# Altium schematic sheet Sheet3.SchDoc
size A4; SheetNumber: 2; SheetTotal: 2
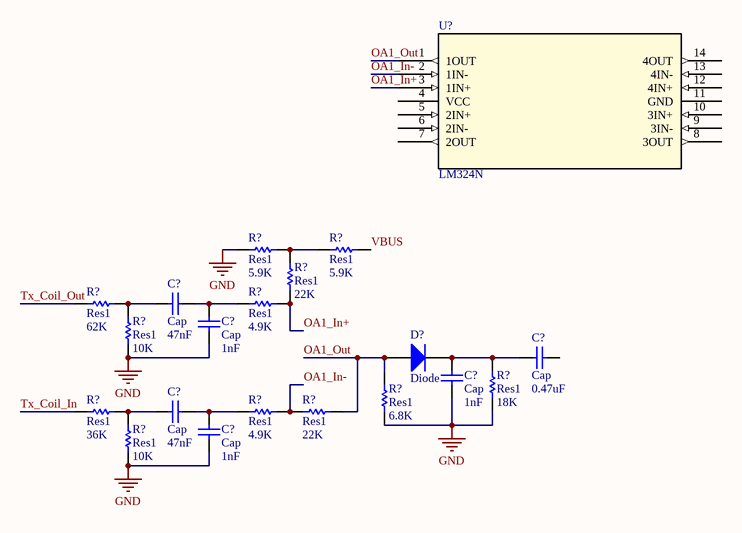
[diagram p0: Sheet3.SchDoc]

## Parts
(Parts that share a designator on the sheet are numbered #1, #2 ... from top to bottom, then left to right.)
C?#1  Cap  value 47nF  [RAD-0.3]
C?#2  Cap  value 1nF  [RAD-0.3]
C?#3  Cap  value 0.47uF  [RAD-0.3]
C?#4  Cap  value 1nF  [RAD-0.3]
C?#5  Cap  value 47nF  [RAD-0.3]
C?#6  Cap  value 1nF  [RAD-0.3]
D?  Diode  [SMC]
R?#1  Res1  value 5.9K  [AXIAL-0.3]
R?#2  Res1  value 5.9K  [AXIAL-0.3]
R?#3  Res1  value 22K  [AXIAL-0.3]
R?#4  Res1  value 62K  [AXIAL-0.3]
R?#5  Res1  value 10K  [AXIAL-0.3]
R?#6  Res1  value 4.9K  [AXIAL-0.3]
R?#7  Res1  value 18K  [AXIAL-0.3]
R?#8  Res1  value 6.8K  [AXIAL-0.3]
R?#9  Res1  value 36K  [AXIAL-0.3]
R?#10  Res1  value 4.9K  [AXIAL-0.3]
R?#11  Res1  value 22K  [AXIAL-0.3]
R?#12  Res1  value 10K  [AXIAL-0.3]
U?  LM324N  [N14]

## Nets
GND: C?#2.1 C?#4.2 C?#6.2 R?#2.2 R?#5.2 R?#7.2 R?#8.2 R?#12.1
OA1_In+: R?#3.2 R?#6.1 U?.3(1IN+)
OA1_In-: R?#10.2 R?#11.1 U?.2(1IN-)
OA1_Out: D?.1(A) R?#8.1 R?#11.2 U?.1(1OUT)
Tx_Coil_In: R?#9.1
Tx_Coil_Out: R?#4.2
VBUS: R?#1.2
NetC?#1_1: C?#1.1 R?#4.1 R?#5.1
NetC?#1_2: C?#1.2 C?#2.2 R?#6.2
NetC?#3_1: C?#3.1 C?#4.1 D?.2(K) R?#7.1
NetC?#5_1: C?#5.1 R?#9.2 R?#12.2
NetC?#5_2: C?#5.2 C?#6.1 R?#10.1
NetR?#1_1: R?#1.1 R?#2.1 R?#3.1

Not connected (* = marked no-connect by the designer): C?#3 2; U? 4(VCC) 5(2IN+) 6(2IN-) 7(2OUT) 8(3OUT) 9(3IN-) 10(3IN+) 11(GND) 12(4IN+) 13(4IN-) 14(4OUT)

## Library data of the parts
C?#1-C?#6 = Cap: Capacitor; Published: 8-Jun-2000; LatestRevisionDate: 17-Jul-2002; LatestRevisionNote: Re-released for DXP Platform.; PackageReference: RAD-0.3; Publisher: Altium Limited; PackageDescription: Radial Cap, Thru-Hole; 2 Leads; 0.3 in Pin Spacing
D? = Diode: Default Diode; Published: 8-Jun-2000; LatestRevisionDate: 17-Jul-2002; LatestRevisionNote: Re-released for DXP Platform.; PackageVersion: Sep-1996; PackageReference: SMC; Publisher: Altium Limited; PackageDescription: DO-214-AB/SMC; 2 C-Bend Leads; Body 7.9 x 5.9 mm, inc. leads (LxW); Code_JEDEC: DO-214-AB
R?#1-R?#12 = Res1: Resistor; Published: 8-Jun-2000; LatestRevisionDate: 17-Jul-2002; LatestRevisionNote: Re-released for DXP Platform.; PackageReference: AXIAL-0.3; Publisher: Altium Limited; PackageDescription: Axial Device, Thru-Hole; 2 Leads; 0.3 in Pin Spacing
U? = LM324N: No Description Available; Mfr_Name: Texas Instruments; RefDes: RefDes; Type: Type